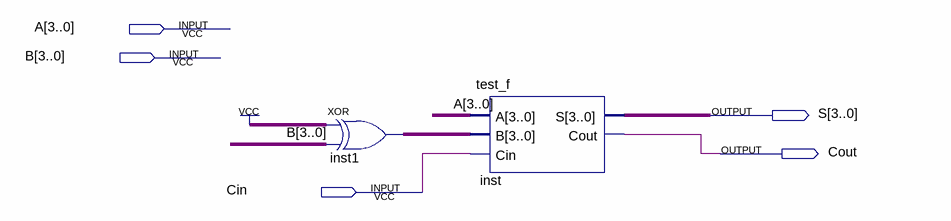
[diagram p0: schematic sheet]
// Quartus schematic test.bdf as structural Verilog: 2 symbols, 5 pins
module test (
  input  [3:0] A,
  input  [3:0] B,
  input  Cin,
  output [3:0] S,
  output Cout
);

  wire [3:0] inst1_out;

  assign inst1_out = 4'b1111 ^ B;  // XOR inst1, 4 bits wide
  test_f inst (.A(A), .B(inst1_out), .Cin(Cin), .S(S), .Cout(Cout));
endmodule
